# Altium schematic sheet 0180_WiFi_BT, LAN, WWAN.SchDoc
size 848 x 558 mm
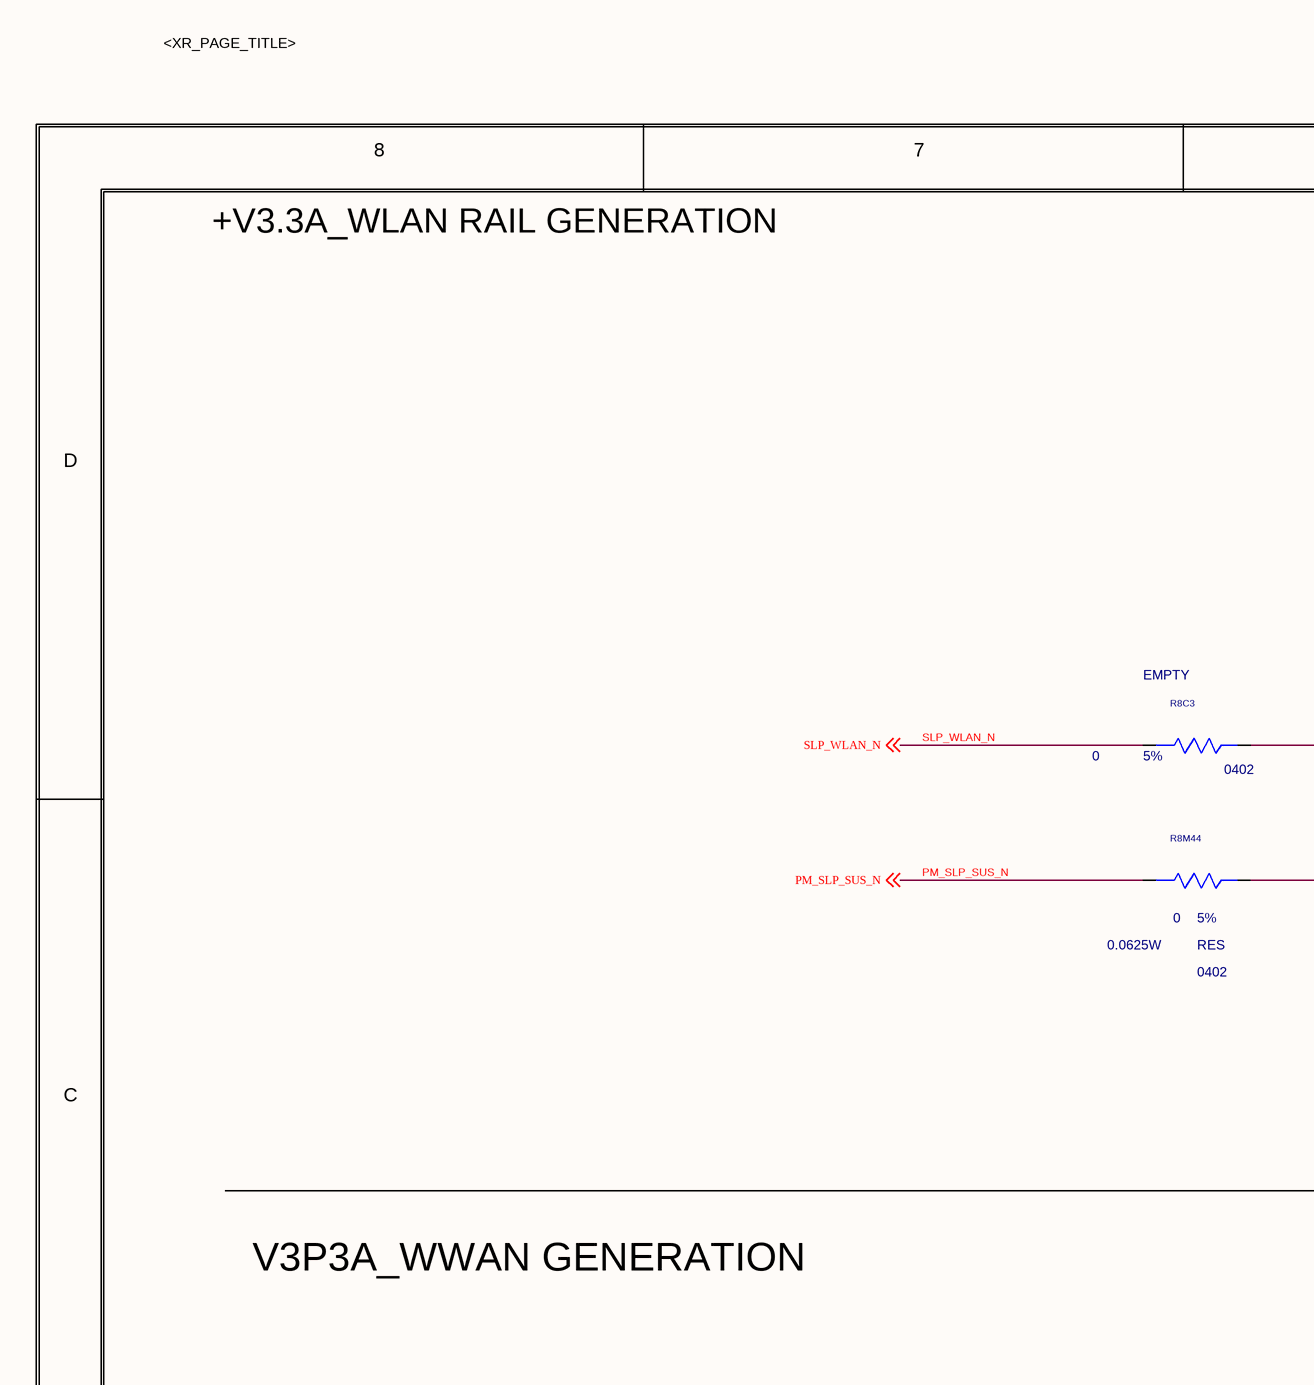
[diagram p0: 0180_WiFi_BT, LAN, WWAN.SchDoc, top left]
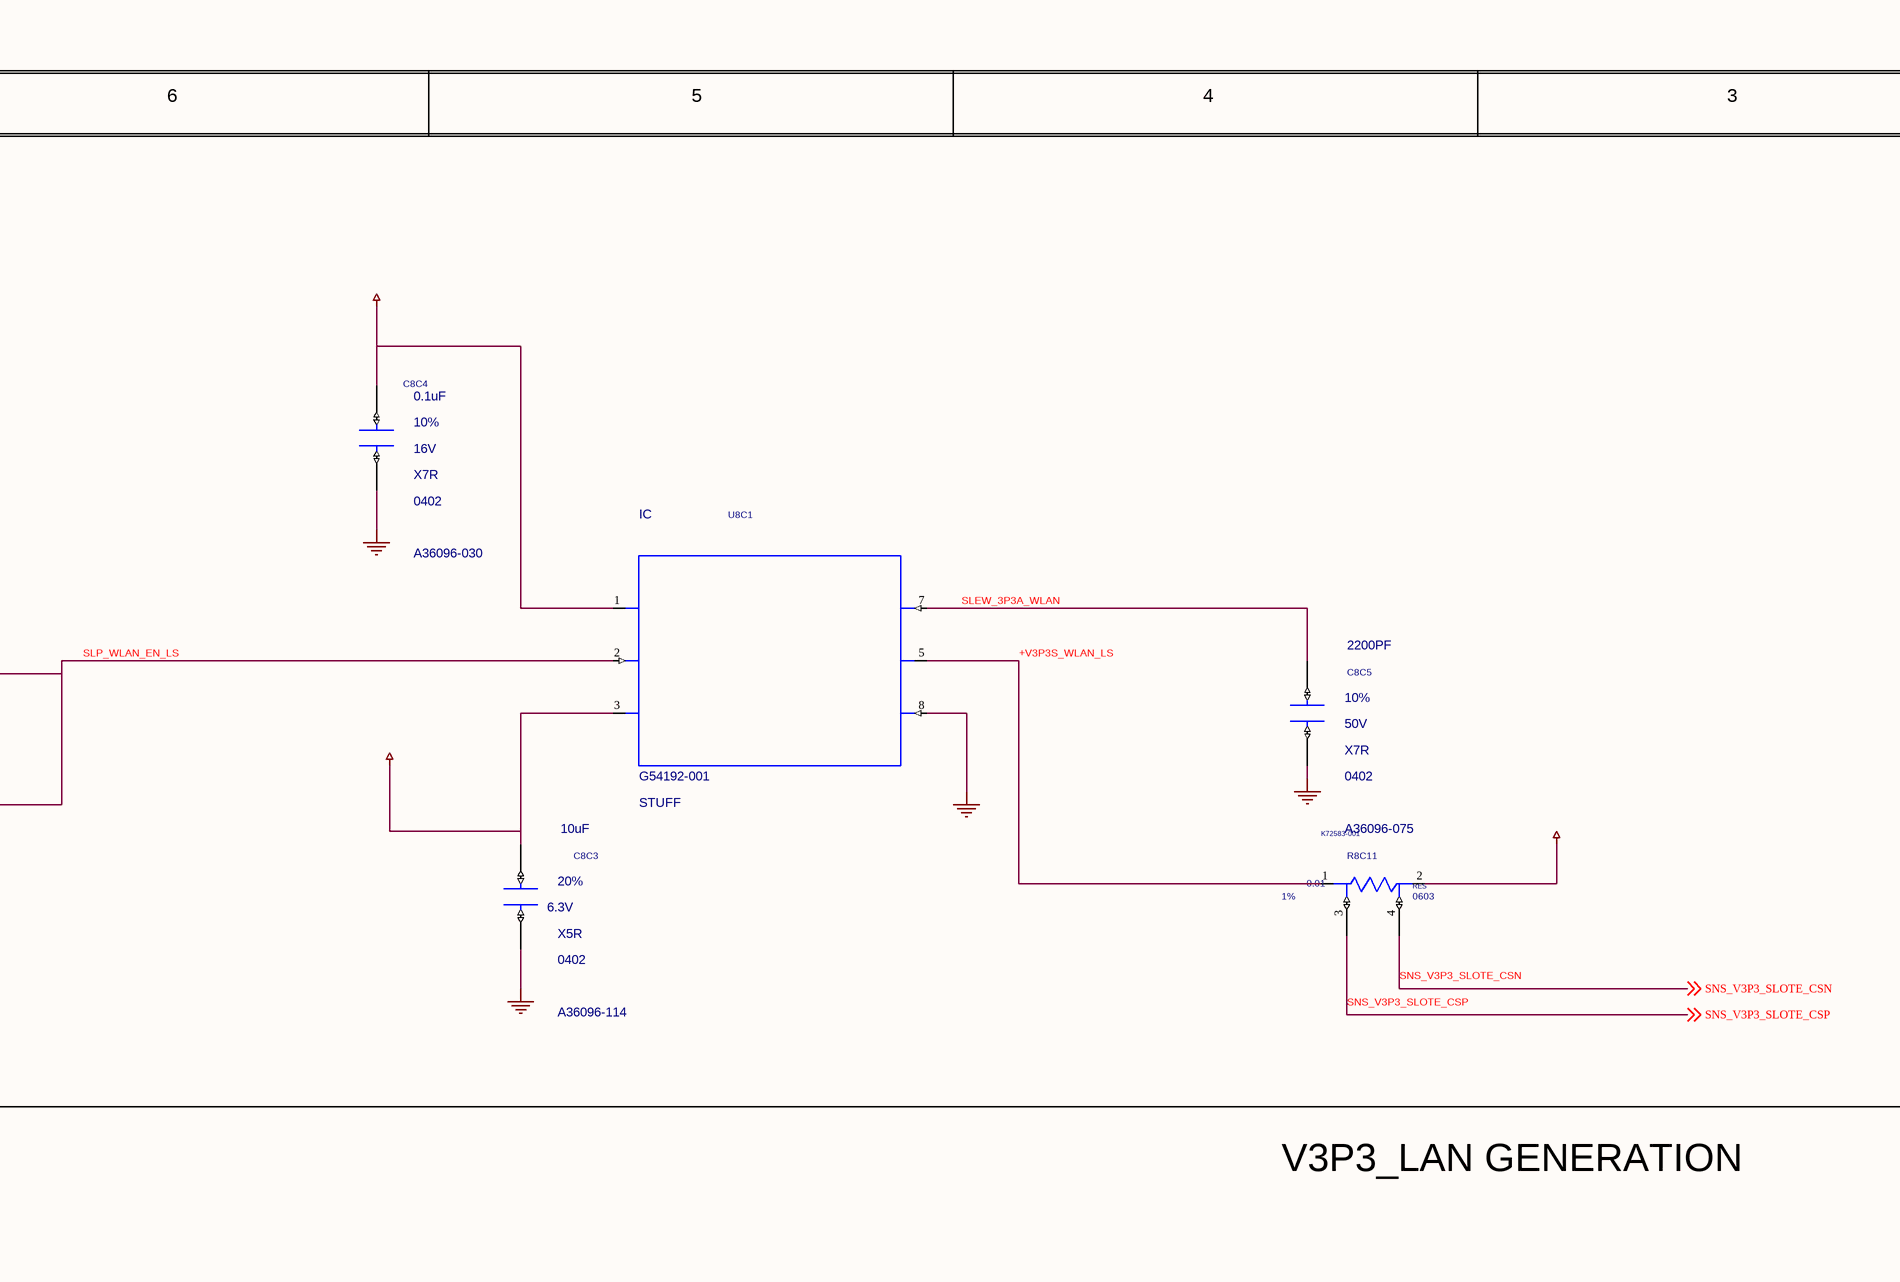
[diagram p1: 0180_WiFi_BT, LAN, WWAN.SchDoc, top middle]
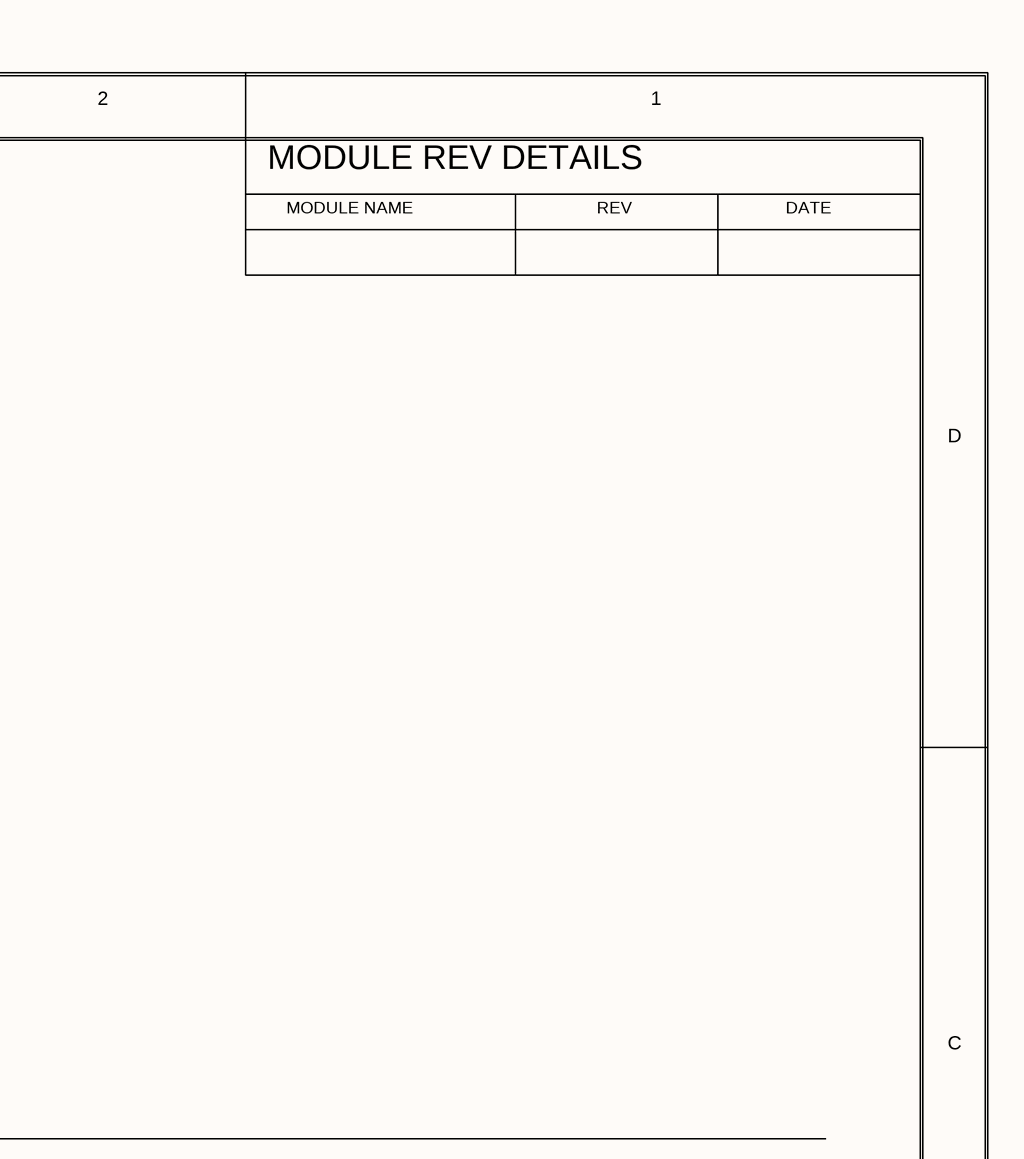
[diagram p2: 0180_WiFi_BT, LAN, WWAN.SchDoc, top right]
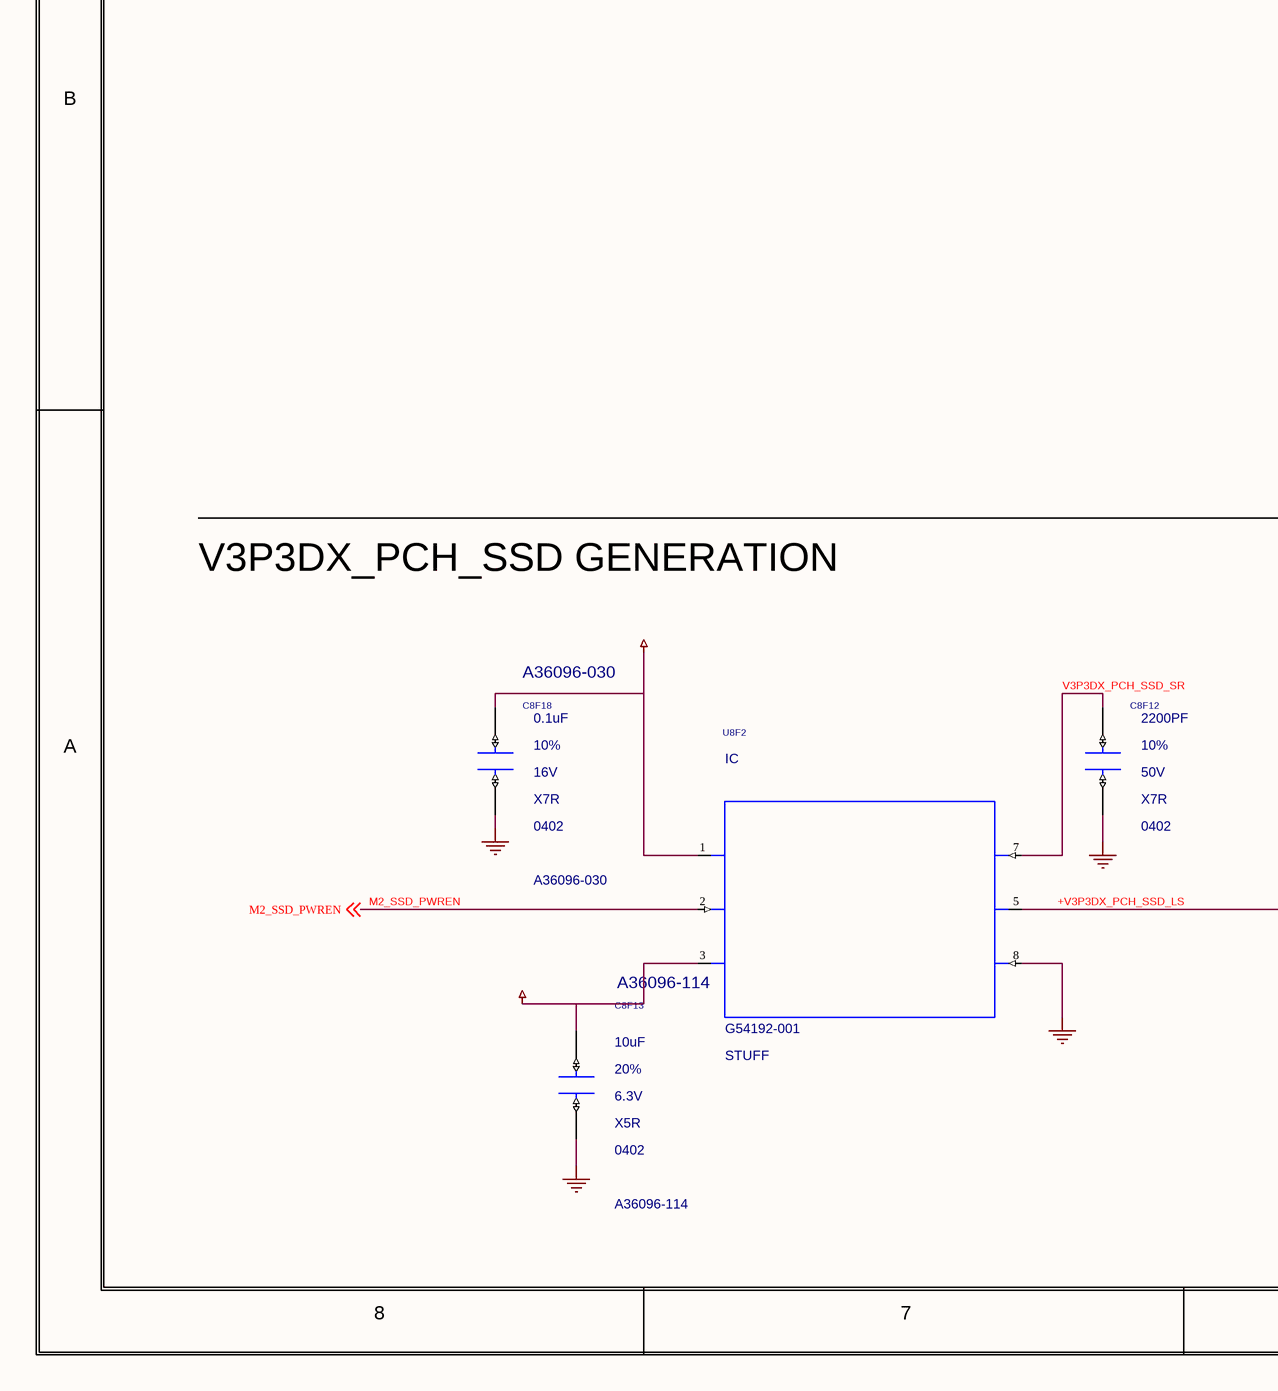
[diagram p3: 0180_WiFi_BT, LAN, WWAN.SchDoc, bottom left]
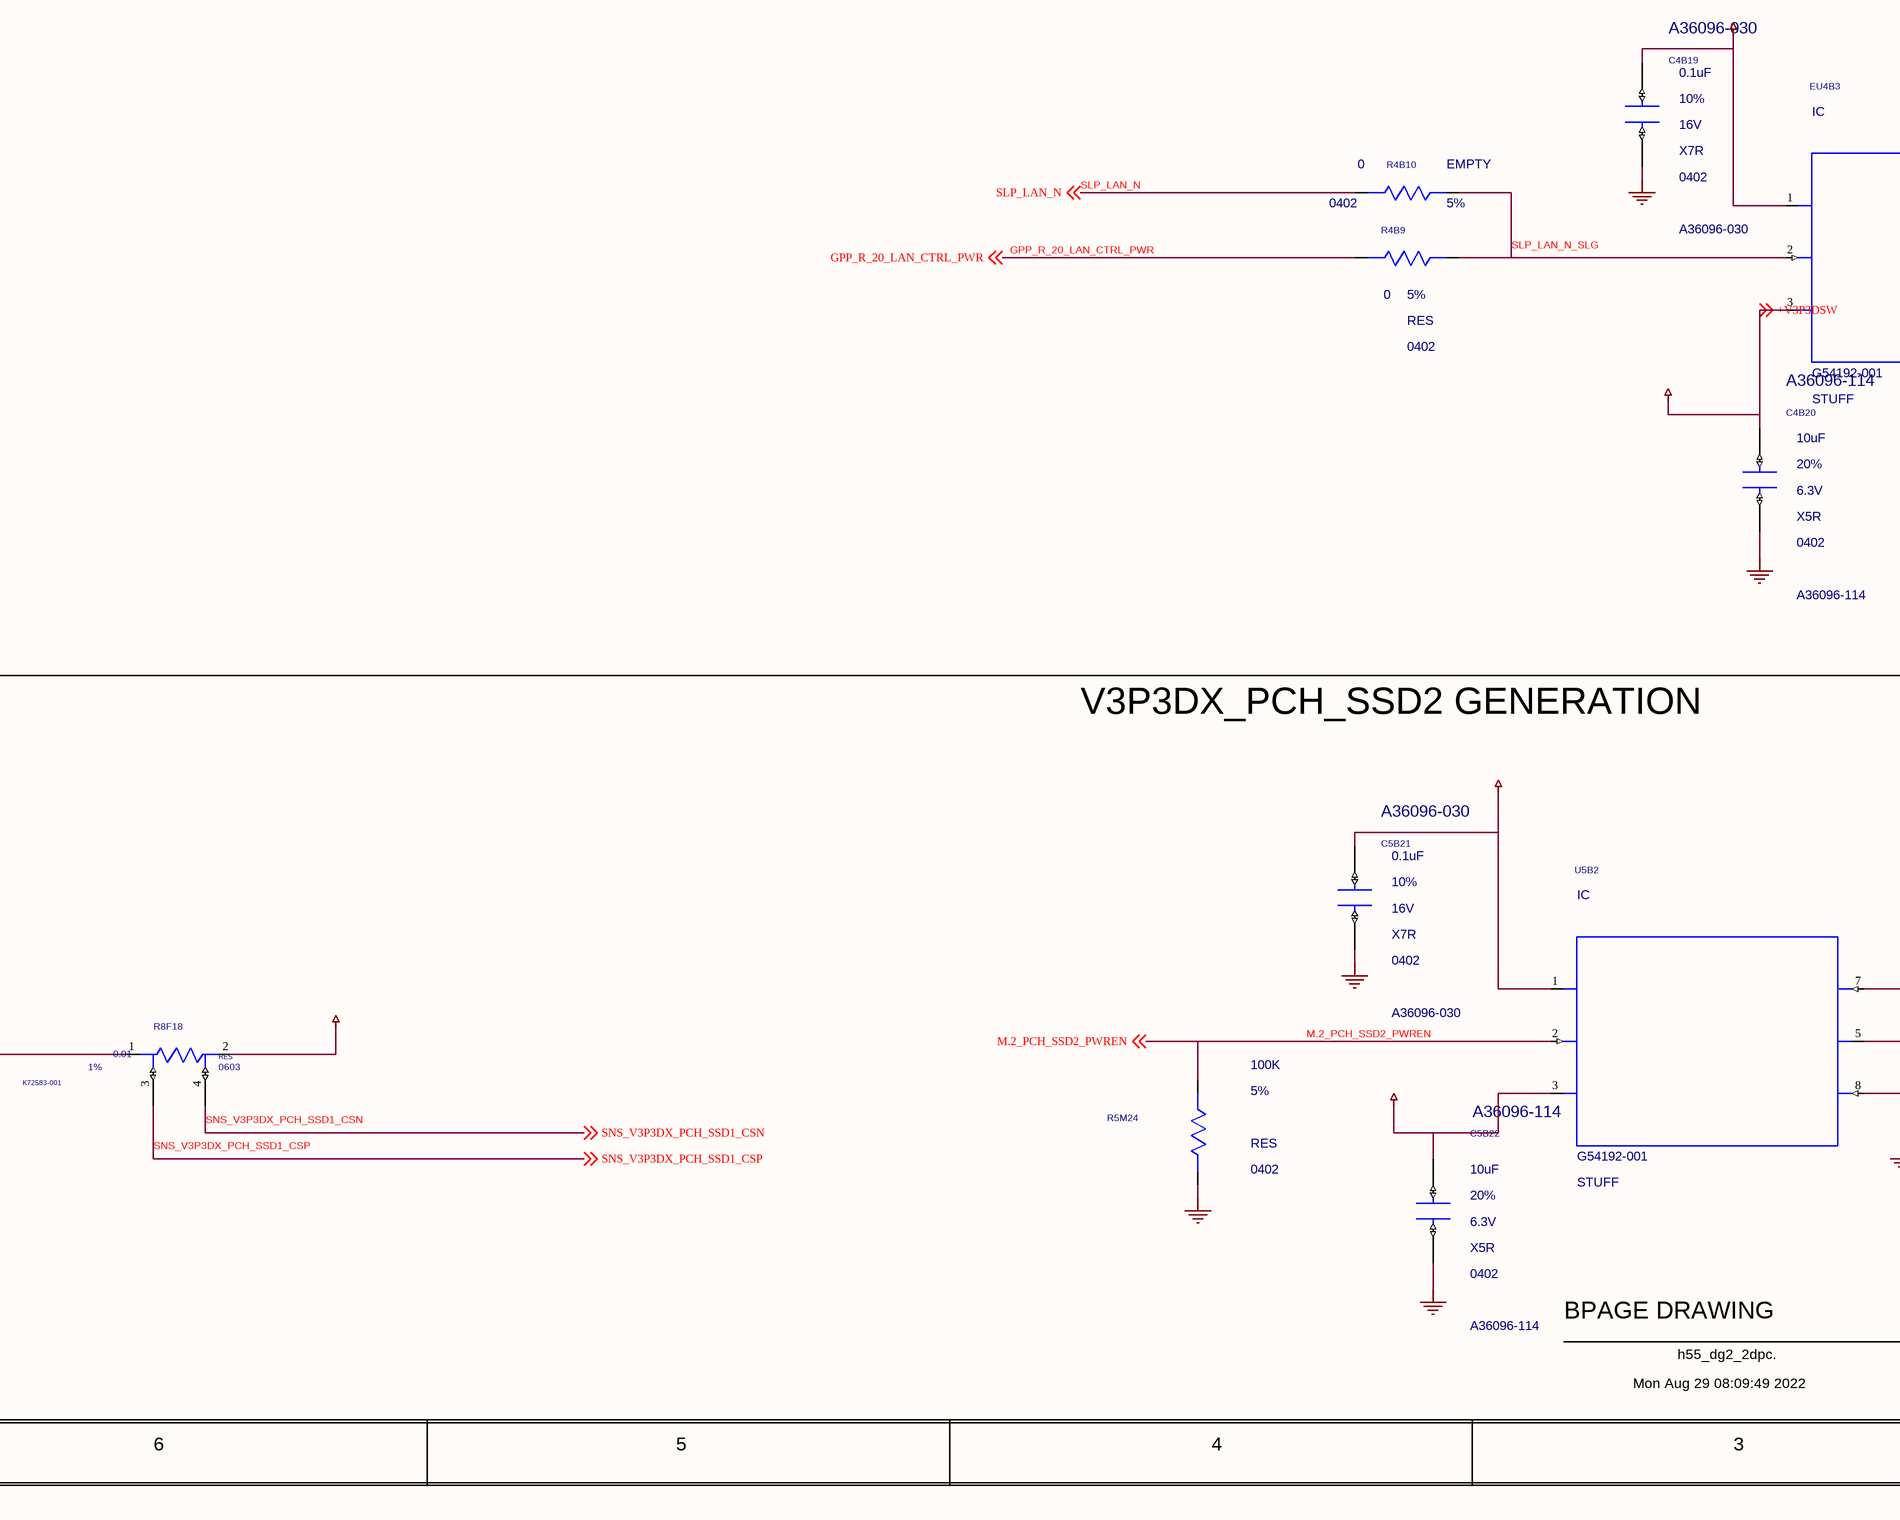
[diagram p4: 0180_WiFi_BT, LAN, WWAN.SchDoc, bottom middle]
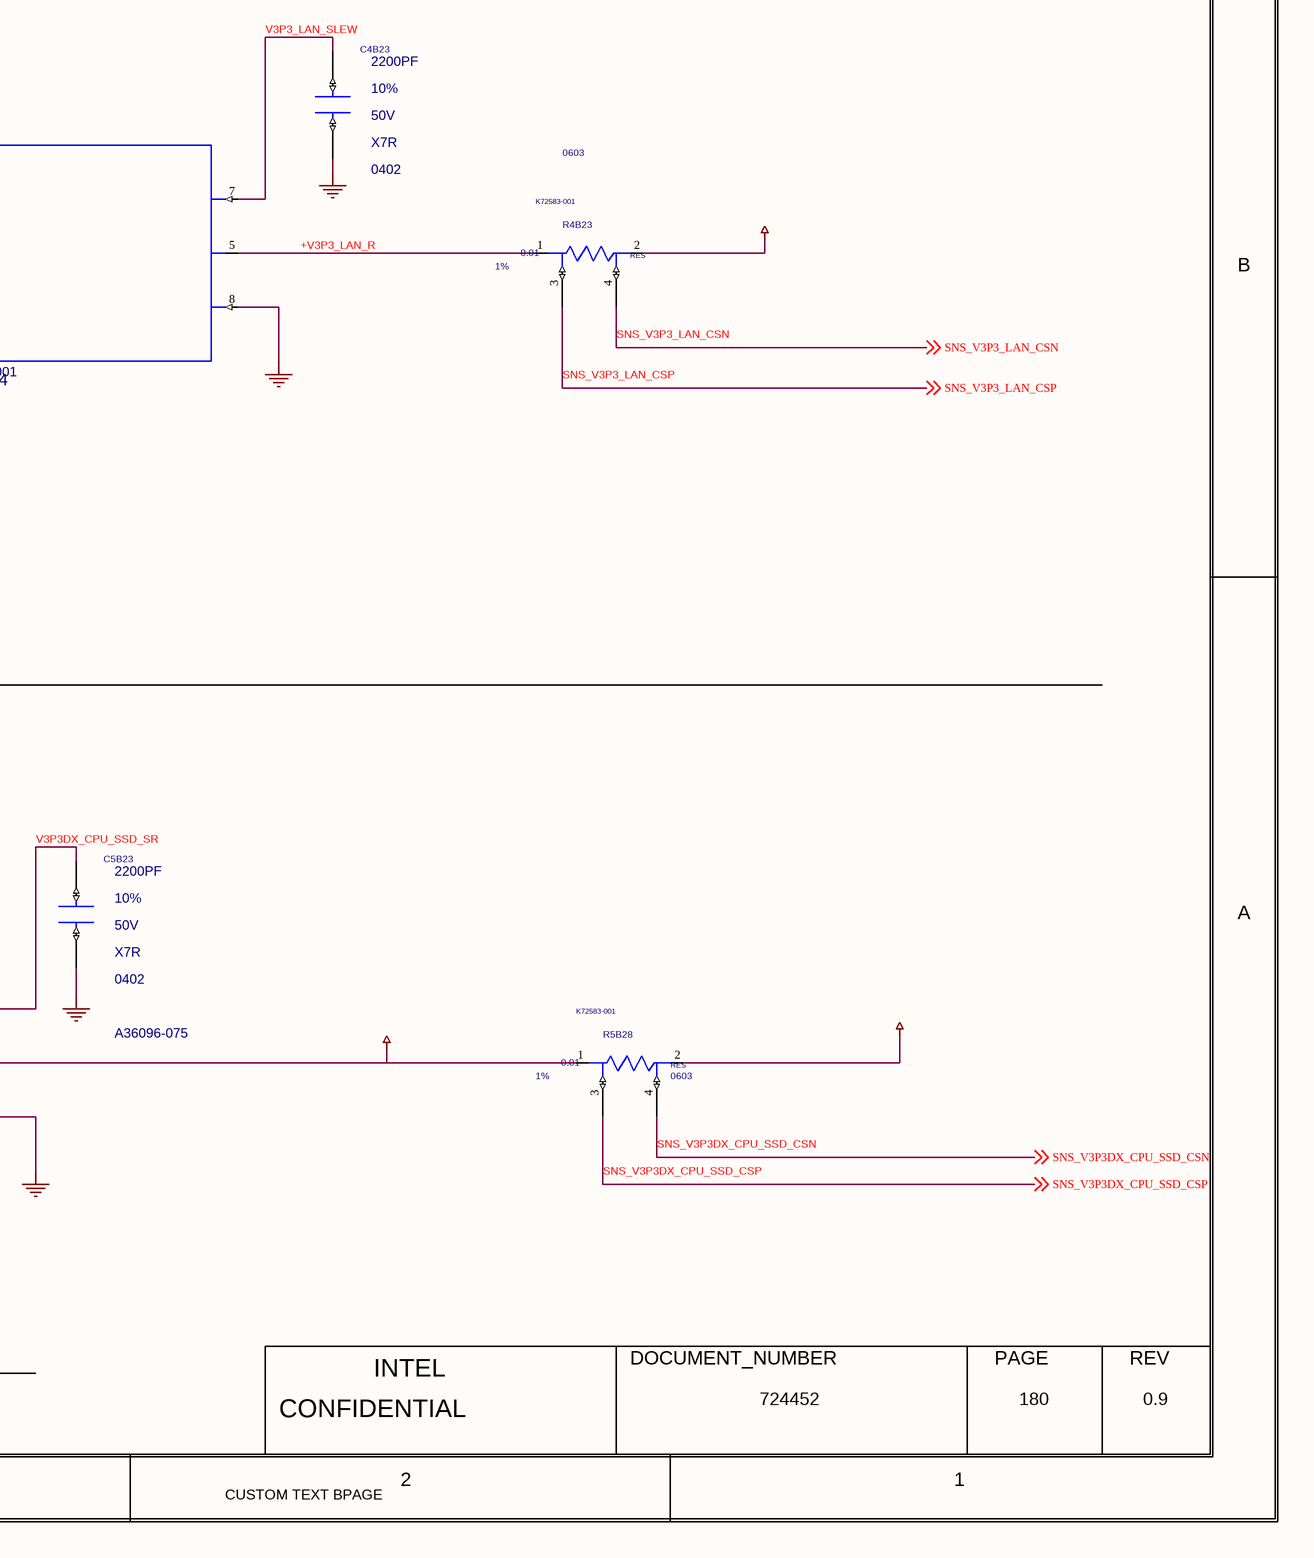
[diagram p5: 0180_WiFi_BT, LAN, WWAN.SchDoc, bottom right]

## Parts
C4B19  0.1uF  MATERIAL: X7R  PACK_TYPE: 0402  PART_NUMBER: A36096-030  TOLERANCE: 10%  VOLTAGE: 16V  [CTK0_SM0402_1050X550_MA]
C4B20  10uF  MATERIAL: X5R  PACK_TYPE: 0402  PART_NUMBER: A36096-114  TOLERANCE: 20%  VOLTAGE: 6.3V  [CTK0_SM0402_1200X700_MA]
C4B23  2200PF  MATERIAL: X7R  PACK_TYPE: 0402  TOLERANCE: 10%  VOLTAGE: 50V  [CTK0_SM0402_1100X600_MA]
C5B21  0.1uF  MATERIAL: X7R  PACK_TYPE: 0402  PART_NUMBER: A36096-030  TOLERANCE: 10%  VOLTAGE: 16V  [CTK0_SM0402_1050X550_MA]
C5B22  10uF  MATERIAL: X5R  PACK_TYPE: 0402  PART_NUMBER: A36096-114  TOLERANCE: 20%  VOLTAGE: 6.3V  [CTK0_SM0402_1200X700_MA]
C5B23  2200PF  MATERIAL: X7R  PACK_TYPE: 0402  PART_NUMBER: A36096-075  TOLERANCE: 10%  VOLTAGE: 50V  [CTK0_SM0402_1100X600_MA]
C8C3  10uF  MATERIAL: X5R  PACK_TYPE: 0402  PART_NUMBER: A36096-114  TOLERANCE: 20%  VOLTAGE: 6.3V  [CTK2_SM0402_1200X700_MA]
C8C4  0.1uF  MATERIAL: X7R  PACK_TYPE: 0402  PART_NUMBER: A36096-030  TOLERANCE: 10%  VOLTAGE: 16V  [CTK0_SM0402_1050X550_MA]
C8C5  2200PF  MATERIAL: X7R  PACK_TYPE: 0402  PART_NUMBER: A36096-075  TOLERANCE: 10%  VOLTAGE: 50V  [CTK0_SM0402_1100X600_MA]
C8F12  2200PF  MATERIAL: X7R  PACK_TYPE: 0402  TOLERANCE: 10%  VOLTAGE: 50V  [CTK0_SM0402_1100X600_MA]
C8F13  10uF  MATERIAL: X5R  PACK_TYPE: 0402  PART_NUMBER: A36096-114  TOLERANCE: 20%  VOLTAGE: 6.3V  [CTK0_SM0402_1200X700_MA]
C8F18  0.1uF  MATERIAL: X7R  PACK_TYPE: 0402  PART_NUMBER: A36096-030  TOLERANCE: 10%  VOLTAGE: 16V  [CTK0_SM0402_1050X550_MA]
EU4B3  BOM_USE: STUFF  MATERIAL: IC  PART_NUMBER: G54192-001  [TK2_LCC8_1550X2050_500_MA]  (hidden comment: SLG7NT402V_2)
R4B9  0  MATERIAL: RES  PACK_TYPE: 0402  TOLERANCE: 5%  [CTK2_SM0402_1100X550_MA]
R4B10  0  MATERIAL: EMPTY  PACK_TYPE: 0402  TOLERANCE: 5%  [CTK2_SM0402_1100X550_MA]
R4B23  0.01  MATERIAL: RES  PACK_TYPE: 0603  PART_NUMBER: K72583-001  TOLERANCE: 1%  [TK0_SMR4_0603_1800X1014_MB]
R5B28  0.01  MATERIAL: RES  PACK_TYPE: 0603  PART_NUMBER: K72583-001  TOLERANCE: 1%  [TK0_SMR4_0603_1800X1014_MB]
R5M24  100K  MATERIAL: RES  PACK_TYPE: 0402  TOLERANCE: 5%  [CTK2_SM0402_1100X550_MA]
R8C3  0  MATERIAL: EMPTY  PACK_TYPE: 0402  TOLERANCE: 5%  [CTK2_SM0402_1100X550_MA]
R8C11  0.01  MATERIAL: RES  PACK_TYPE: 0603  PART_NUMBER: K72583-001  TOLERANCE: 1%  [TK0_SMR4_0603_1800X1014_MB]
R8F18  0.01  MATERIAL: RES  PACK_TYPE: 0603  PART_NUMBER: K72583-001  TOLERANCE: 1%  [TK0_SMR4_0603_1800X1014_MB]
R8M44  0  MATERIAL: RES  PACK_TYPE: 0402  TOLERANCE: 5%  WATTAGE: 0.0625W  [CTK2_SM0402_1100X550_MA]
U5B2  BOM_USE: STUFF  MATERIAL: IC  PART_NUMBER: G54192-001  [TK2_LCC8_1550X2050_500_MA]  (hidden comment: SLG7NT402V_2)
U8C1  BOM_USE: STUFF  MATERIAL: IC  PART_NUMBER: G54192-001  [TK2_LCC8_1550X2050_500_MA]  (hidden comment: SLG7NT402V_2)
U8F2  BOM_USE: STUFF  MATERIAL: IC  PART_NUMBER: G54192-001  [TK2_LCC8_1550X2050_500_MA]  (hidden comment: SLG7NT402V_2)

## Nets
+V3P3_LAN: R4B23.2(PWRB)
+V3P3_SLOTE: R8C11.2(PWRB)
+V3P3DSW: C4B19.1(A) C4B20.1(A) C5B21.1(A) C5B22.1(A) C8C3.1(A) C8C4.1(A) C8F13.1(A) C8F18.1(A) EU4B3.1(VDD) EU4B3.3(D) U5B2.1(VDD) U5B2.3(D) U8C1.1(VDD) U8C1.3(D) U8F2.1(VDD) U8F2.3(D) ; off-sheet +V3P3DSW
+V3P3DX_PCH_SSD: R8F18.2(PWRB)
+V3P3DX_PCH_SSD2: R5B28.2(PWRB)
+V3P3DX_PCH_SSD2_LS: R5B28.1(PWRA) U5B2.5(S)
GND: C4B19.2(B) C4B20.2(B) C4B23.2(B) C5B21.2(B) C5B22.2(B) C5B23.2(B) C8C3.2(B) C8C4.2(B) C8C5.2(B) C8F12.2(B) C8F13.2(B) C8F18.2(B) EU4B3.8(GND) R5M24.2(B) U5B2.8(GND) U8C1.8(GND) U8F2.8(GND)
+V3P3_LAN_R: EU4B3.5(S) R4B23.1(PWRA)
+V3P3DX_PCH_SSD_LS: R8F18.1(PWRA) U8F2.5(S)
+V3P3S_WLAN_LS: R8C11.1(PWRA) U8C1.5(S)
GPP_R_20_LAN_CTRL_PWR: R4B9.1(A) ; off-sheet GPP_R_20_LAN_CTRL_PWR
M2_SSD_PWREN: U8F2.2(ON) ; off-sheet M2_SSD_PWREN
M.2_PCH_SSD2_PWREN: R5M24.1(A) U5B2.2(ON) ; off-sheet M.2_PCH_SSD2_PWREN
PM_SLP_SUS_N: R8M44.1(A) ; off-sheet PM_SLP_SUS_N
SLEW_3P3A_WLAN: C8C5.1(A) U8C1.7(CAP)
SLP_LAN_N: R4B10.1(A) ; off-sheet SLP_LAN_N
SLP_LAN_N_SLG: EU4B3.2(ON) R4B9.2(B) R4B10.2(B)
SLP_WLAN_EN_LS: R8C3.2(B) R8M44.2(B) U8C1.2(ON)
SLP_WLAN_N: R8C3.1(A) ; off-sheet SLP_WLAN_N
SNS_V3P3_LAN_CSN: R4B23.4(SENB) ; off-sheet SNS_V3P3_LAN_CSN
SNS_V3P3_LAN_CSP: R4B23.3(SENA) ; off-sheet SNS_V3P3_LAN_CSP
SNS_V3P3_SLOTE_CSN: R8C11.4(SENB) ; off-sheet SNS_V3P3_SLOTE_CSN
SNS_V3P3_SLOTE_CSP: R8C11.3(SENA) ; off-sheet SNS_V3P3_SLOTE_CSP
SNS_V3P3DX_CPU_SSD_CSN: R5B28.4(SENB) ; off-sheet SNS_V3P3DX_CPU_SSD_CSN
SNS_V3P3DX_CPU_SSD_CSP: R5B28.3(SENA) ; off-sheet SNS_V3P3DX_CPU_SSD_CSP
SNS_V3P3DX_PCH_SSD1_CSN: R8F18.4(SENB) ; off-sheet SNS_V3P3DX_PCH_SSD1_CSN
SNS_V3P3DX_PCH_SSD1_CSP: R8F18.3(SENA) ; off-sheet SNS_V3P3DX_PCH_SSD1_CSP
V3P3_LAN_SLEW: C4B23.1(A) EU4B3.7(CAP)
V3P3DX_CPU_SSD_SR: C5B23.1(A) U5B2.7(CAP)
V3P3DX_PCH_SSD_SR: C8F12.1(A) U8F2.7(CAP)

## Notes on the sheet
- <XR_PAGE_TITLE>
- 8
- 7
- 6
- 5
- 4
- 3
- 2
- 1
- +V3.3A_WLAN RAIL GENERATION
- MODULE REV DETAILS
- MODULE NAME
- REV
- DATE
- D
- C
- V3P3_LAN GENERATION
- V3P3A_WWAN GENERATION
- B
- V3P3DX_PCH_SSD GENERATION
- V3P3DX_PCH_SSD2 GENERATION
- A
- BPAGE DRAWING
- INTEL
- DOCUMENT_NUMBER
- PAGE
- Mon Aug 29 08:09:49 2022
- h55_dg2_2dpc.
- CONFIDENTIAL
- 724452
- 180
- 0.9
- CUSTOM TEXT BPAGE

## Library data of the parts
C4B19 = C_CAP: CDS_PHYS_PART_NAME: C_CAP_0402-A36096-030,X7R,0.1UF,16V,10%,TK0,GENERIC; CDS_LMAN_SYM_OUTLINE: -50,50,50,-50; FP_TECH: TK0; IP: GENERIC; ROOM: NONE; OriginalSymbolOrigin: (-50,25); XY: (4800,5025); VER: 1; ROT: 0; PHYS_PAGE: 180; LOCATION: C4B19; DRAWING: @RVP1_ADL_SB_ADP_S_DDR5_SODIMM_2DPC_LIB.H55_DG2_2DPC(SCH_1):PAGE549; CDS_LIB: c_discrete; VARIANT: ?; PCB Footprint: CTK0_SM0402_1050X550_MA; CHIPS_PART_NAME: C_CAP; CDS_PART_NAME: C_CAP_0402-A36096-030,X7R,0.1UF,16V,10%,TK0,GENERIC; CDS_LOCATION: C4B19; ASI_MODEL: A36096-030
C4B20 = C_CAP: CDS_PHYS_PART_NAME: C_CAP_0402-A36096-114,X5R,10UF,6.3V,20%,TK0,GENERIC; CDS_LMAN_SYM_OUTLINE: -50,50,50,-50; FP_TECH: TK0; IP: GENERIC; ROOM: NONE; OriginalSymbolOrigin: (-50,25); XY: (5025,4325); VER: 1; ROT: 0; PHYS_PAGE: 180; LOCATION: C4B20; FIN: VREG_CPU_DCPL; DRAWING: @RVP1_ADL_SB_ADP_S_DDR5_SODIMM_2DPC_LIB.H55_DG2_2DPC(SCH_1):PAGE549; CDS_LIB: c_discrete; BOM: CORE_VREG_CPU; VARIANT: ?; PCB Footprint: CTK0_SM0402_1200X700_MA; CHIPS_PART_NAME: C_CAP; CDS_PART_NAME: C_CAP_0402-A36096-114,X5R,10UF,6.3V,20%,TK0,GENERIC; CDS_LOCATION: C4B20; ASI_MODEL: A36096-114
C4B23 = C_CAP: PART_NUMBER: A36096-075; CDS_PHYS_PART_NAME: CAP_402-2200PF,10%,50V"; CDS_PART_NAME: C_CAP_0402-A36096-075,X7R,2200PF,50V,10%,TK0,GENERIC; CDS_LMAN_SYM_OUTLINE: -50,50,50,-50; FP_TECH: TK0; IP: GENERIC; ROOM: NONE; OriginalSymbolOrigin: (-50,25); XY: (5850,5025); VER: 1; ROT: 0; PHYS_PAGE: 180; LOCATION: C4B23; DRAWING: @RVP1_ADL_SB_ADP_S_DDR5_SODIMM_2DPC_LIB.H55_DG2_2DPC(SCH_1):PAGE549; CDS_LIB: c_discrete; VARIANT: ?; PCB Footprint: CTK0_SM0402_1100X600_MA; CHIPS_PART_NAME: C_CAP; CDS_LOCATION: C4B23; ASI_MODEL: A36096-075
C5B21 = C_CAP: CDS_PHYS_PART_NAME: C_CAP_0402-A36096-030,X7R,0.1UF,16V,10%,TK0,GENERIC; CDS_LMAN_SYM_OUTLINE: -50,50,50,-50; FP_TECH: TK0; IP: GENERIC; ROOM: NONE; OriginalSymbolOrigin: (-50,25); XY: (4250,3525); VER: 1; ROT: 0; PHYS_PAGE: 180; LOCATION: C5B21; DRAWING: @RVP1_ADL_SB_ADP_S_DDR5_SODIMM_2DPC_LIB.H55_DG2_2DPC(SCH_1):PAGE549; CDS_LIB: c_discrete; VARIANT: ?; PCB Footprint: CTK0_SM0402_1050X550_MA; CHIPS_PART_NAME: C_CAP; CDS_PART_NAME: C_CAP_0402-A36096-030,X7R,0.1UF,16V,10%,TK0,GENERIC; CDS_LOCATION: C5B21; ASI_MODEL: A36096-030
C5B22 = C_CAP: CDS_PHYS_PART_NAME: C_CAP_0402-A36096-114,X5R,10UF,6.3V,20%,TK0,GENERIC; CDS_LMAN_SYM_OUTLINE: -50,50,50,-50; FP_TECH: TK0; IP: GENERIC; ROOM: NONE; OriginalSymbolOrigin: (-50,25); XY: (4400,2925); VER: 1; ROT: 0; PHYS_PAGE: 180; LOCATION: C5B22; FIN: VREG_CPU_DCPL; DRAWING: @RVP1_ADL_SB_ADP_S_DDR5_SODIMM_2DPC_LIB.H55_DG2_2DPC(SCH_1):PAGE549; CDS_LIB: c_discrete; BOM: CORE_VREG_CPU; VARIANT: ?; PCB Footprint: CTK0_SM0402_1200X700_MA; CHIPS_PART_NAME: C_CAP; CDS_PART_NAME: C_CAP_0402-A36096-114,X5R,10UF,6.3V,20%,TK0,GENERIC; CDS_LOCATION: C5B22; ASI_MODEL: A36096-114
C5B23 = C_CAP: CDS_PHYS_PART_NAME: C_CAP_0402-A36096-075,X7R,2200PF,50V,10%,TK0,GENERIC; CDS_LMAN_SYM_OUTLINE: -50,50,50,-50; FP_TECH: TK0; IP: GENERIC; ROOM: NONE; OriginalSymbolOrigin: (-50,25); XY: (5375,3525); VER: 1; ROT: 0; PHYS_PAGE: 180; LOCATION: C5B23; DRAWING: @RVP1_ADL_SB_ADP_S_DDR5_SODIMM_2DPC_LIB.H55_DG2_2DPC(SCH_1):PAGE549; CDS_LIB: c_discrete; VARIANT: ?; PCB Footprint: CTK0_SM0402_1100X600_MA; CHIPS_PART_NAME: C_CAP; CDS_PART_NAME: C_CAP_0402-A36096-075,X7R,2200PF,50V,10%,TK0,GENERIC; CDS_LOCATION: C5B23; ASI_MODEL: A36096-075
C8C3 = C_CAP: CDS_PHYS_PART_NAME: C_CAP_0402-A36096-114,X5R,10UF,6.3V,20%,TK2,GENERIC; CDS_LMAN_SYM_OUTLINE: -50,50,50,-50; FP_TECH: TK2; IP: GENERIC; ROOM: NONE; OriginalSymbolOrigin: (-50,25); XY: (2650,6075); VER: 1; ROT: 0; PHYS_PAGE: 180; LOCATION: C8C3; DRAWING: @RVP1_ADL_SB_ADP_S_DDR5_SODIMM_2DPC_LIB.H55_DG2_2DPC(SCH_1):PAGE549; CDS_LIB: c_discrete; VARIANT: ?; PCB Footprint: CTK2_SM0402_1200X700_MA; CHIPS_PART_NAME: C_CAP; CDS_PART_NAME: C_CAP_0402-A36096-114,X5R,10UF,6.3V,20%,TK2,GENERIC; CDS_LOCATION: C8C3
C8C4 = C_CAP: CDS_PHYS_PART_NAME: C_CAP_0402-A36096-030,X7R,0.1UF,16V,10%,TK0,GENERIC; CDS_LMAN_SYM_OUTLINE: -50,50,50,-50; FP_TECH: TK0; IP: GENERIC; ROOM: NONE; OriginalSymbolOrigin: (-50,25); XY: (2375,6950); VER: 1; ROT: 0; PHYS_PAGE: 180; LOCATION: C8C4; DRAWING: @RVP1_ADL_SB_ADP_S_DDR5_SODIMM_2DPC_LIB.H55_DG2_2DPC(SCH_1):PAGE549; CDS_LIB: c_discrete; VARIANT: ?; PCB Footprint: CTK0_SM0402_1050X550_MA; CHIPS_PART_NAME: C_CAP; CDS_PART_NAME: C_CAP_0402-A36096-030,X7R,0.1UF,16V,10%,TK0,GENERIC; CDS_LOCATION: C8C4
C8C5 = C_CAP: CDS_PHYS_PART_NAME: C_CAP_0402-A36096-075,X7R,2200PF,50V,10%,TK0,GENERIC; CDS_LMAN_SYM_OUTLINE: -50,50,50,-50; FP_TECH: TK0; IP: GENERIC; ROOM: NONE; OriginalSymbolOrigin: (-50,25); XY: (4150,6425); VER: 1; ROT: 0; PHYS_PAGE: 180; LOCATION: C8C5; DRAWING: @RVP1_ADL_SB_ADP_S_DDR5_SODIMM_2DPC_LIB.H55_DG2_2DPC(SCH_1):PAGE549; CDS_LIB: c_discrete; VARIANT: ?; PCB Footprint: CTK0_SM0402_1100X600_MA; CHIPS_PART_NAME: C_CAP; CDS_PART_NAME: C_CAP_0402-A36096-075,X7R,2200PF,50V,10%,TK0,GENERIC; CDS_LOCATION: C8C5
C8F12 = C_CAP: PART_NUMBER: A36096-075; CDS_PHYS_PART_NAME: C_CAP_0402-A36096-075,X7R,2200PF,50V,10%,TK0,GENERIC; CDS_LMAN_SYM_OUTLINE: -50,50,50,-50; FP_TECH: TK0; IP: GENERIC; ROOM: NONE; OriginalSymbolOrigin: (-50,25); XY: (1325,3500); VER: 1; ROT: 0; PHYS_PAGE: 180; LOCATION: C8F12; DRAWING: @RVP1_ADL_SB_ADP_S_DDR5_SODIMM_2DPC_LIB.H55_DG2_2DPC(SCH_1):PAGE549; CDS_LIB: c_discrete; VARIANT: ?; PCB Footprint: CTK0_SM0402_1100X600_MA; CHIPS_PART_NAME: C_CAP; CDS_PART_NAME: C_CAP_0402-A36096-075,X7R,2200PF,50V,10%,TK0,GENERIC; CDS_LOCATION: C8F12; ASI_MODEL: A36096-075
C8F13 = C_CAP: CDS_PHYS_PART_NAME: C_CAP_0402-A36096-114,X5R,10UF,6.3V,20%,TK0,GENERIC; CDS_LMAN_SYM_OUTLINE: -50,50,50,-50; FP_TECH: TK0; IP: GENERIC; ROOM: NONE; OriginalSymbolOrigin: (-50,25); XY: (350,2900); VER: 1; ROT: 0; PHYS_PAGE: 180; LOCATION: C8F13; FIN: VREG_CPU_DCPL; DRAWING: @RVP1_ADL_SB_ADP_S_DDR5_SODIMM_2DPC_LIB.H55_DG2_2DPC(SCH_1):PAGE549; CDS_LIB: c_discrete; BOM: CORE_VREG_CPU; VARIANT: ?; PCB Footprint: CTK0_SM0402_1200X700_MA; CHIPS_PART_NAME: C_CAP; CDS_PART_NAME: C_CAP_0402-A36096-114,X5R,10UF,6.3V,20%,TK0,GENERIC; CDS_LOCATION: C8F13; ASI_MODEL: A36096-114
C8F18 = C_CAP: CDS_PHYS_PART_NAME: C_CAP_0402-A36096-030,X7R,0.1UF,16V,10%,TK0,GENERIC; CDS_LMAN_SYM_OUTLINE: -50,50,50,-50; FP_TECH: TK0; IP: GENERIC; ROOM: NONE; OriginalSymbolOrigin: (-50,25); XY: (200,3500); VER: 1; ROT: 0; PHYS_PAGE: 180; LOCATION: C8F18; DRAWING: @RVP1_ADL_SB_ADP_S_DDR5_SODIMM_2DPC_LIB.H55_DG2_2DPC(SCH_1):PAGE549; CDS_LIB: c_discrete; VARIANT: ?; PCB Footprint: CTK0_SM0402_1050X550_MA; CHIPS_PART_NAME: C_CAP; CDS_PART_NAME: C_CAP_0402-A36096-030,X7R,0.1UF,16V,10%,TK0,GENERIC; CDS_LOCATION: C8F18; ASI_MODEL: A36096-030
EU4B3 = SLG7NT402V_2: CDS_PHYS_PART_NAME: SLG7NT402V_2_LCC-G54192-001,IC,SLG7NT402V,TK2,GENERIC; CDS_LMAN_SYM_OUTLINE: -250,200,250,-200; FP_TECH: TK2; IP: GENERIC; PACK_TYPE: LCC; ROOM: NONE; OriginalSymbolOrigin: (-275,200); XY: (5375,4750); VER: 1; ROT: 0; PHYS_PAGE: 180; LOCATION: EU4B3; DRAWING: @RVP1_ADL_SB_ADP_S_DDR5_SODIMM_2DPC_LIB.H55_DG2_2DPC(SCH_1):PAGE549; CDS_LIB: local; VARIANT: ?; PCB Footprint: TK2_LCC8_1550X2050_500_MA; SEC_TYPE: LCC; CHIPS_PART_NAME: SLG7NT402V_2; CDS_PART_NAME: SLG7NT402V_2_LCC-G54192-001,IC,SLG7NT402V,TK2,GENERIC; CDS_LOCATION: EU4B3; ASI_MODEL: G54192-001
R4B9 = C_RES#1: PART_NUMBER: A93549-001; CHIPS_PART_NAME: C_RES; CDS_PHYS_PART_NAME: C_RES_0402-A93549-001,RES,0,5%,0.0625W,TK2,GENERIC; CDS_LMAN_SYM_OUTLINE: -50,50,50,-50; FP_TECH: TK2; IP: GENERIC; ROOM: NONE; WATTAGE: 0.0625W; OriginalSymbolOrigin: (-75,25); XY: (4350,4750); VER: 1; PHYS_PAGE: 180; LOCATION: R4B9; DRAWING: @RVP1_ADL_SB_ADP_S_DDR5_SODIMM_2DPC_LIB.H55_DG2_2DPC(SCH_1):PAGE549; CDS_LIB: c_discrete; VARIANT: ?; PCB Footprint: CTK2_SM0402_1100X550_MA; ROT: 0; CDS_PART_NAME: C_RES_0402-A93549-001,RES,0,5%,0.0625W,TK2,GENERIC; CDS_LOCATION: R4B9; ASI_MODEL: A93549-001
R4B10 = C_RES#1: PART_NUMBER: A93549-001; CHIPS_PART_NAME: C_RES; CDS_PHYS_PART_NAME: RES_402-0,5%,402"; CDS_PART_NAME: C_RES_0402-A93549-001,EMPTY,0,5%,0.0625W,TK2,GENERIC; CDS_LMAN_SYM_OUTLINE: -50,50,50,-50; FP_TECH: TK2; IP: GENERIC; ROOM: NONE; WATTAGE: 0.0625W; OriginalSymbolOrigin: (-75,25); XY: (4350,4875); VER: 1; PHYS_PAGE: 180; LOCATION: R4B10; DRAWING: @RVP1_ADL_SB_ADP_S_DDR5_SODIMM_2DPC_LIB.H55_DG2_2DPC(SCH_1):PAGE549; CDS_LIB: c_discrete; VARIANT: ?; PCB Footprint: CTK2_SM0402_1100X550_MA; ROT: 0; CDS_LOCATION: R4B10; ASI_MODEL: A93549-001
R4B23 = RES_4TERM_2: CDS_PHYS_PART_NAME: RES_4TERM_2_0603-K72583-001,RES,0.01,1%,0.1W,TK0,GENERIC; CDS_LMAN_SYM_OUTLINE: -50,50,50,-50; FP_TECH: TK0; IP: GENERIC; ROOM: NONE; WATTAGE: 0.1W; OriginalSymbolOrigin: (-75,25); XY: (6325,4750); VER: 1; ROT: 0; PHYS_PAGE: 180; LOCATION: R4B23; DRAWING: @RVP1_ADL_SB_ADP_S_DDR5_SODIMM_2DPC_LIB.H55_DG2_2DPC(SCH_1):PAGE549; CDS_LIB: discrete_2; VARIANT: ?; PCB Footprint: TK0_SMR4_0603_1800X1014_MB; CHIPS_PART_NAME: RES_4TERM_2; CDS_PART_NAME: RES_4TERM_2_0603-K72583-001,RES,0.01,1%,0.1W,TK0,GENERIC; CDS_LOCATION: R4B23; ASI_MODEL: K72583-001
R5B28 = RES_4TERM_2: CDS_PHYS_PART_NAME: RES_4TERM_2_0603-K72583-001,RES,0.01,1%,0.1W,TK0,GENERIC; CDS_LMAN_SYM_OUTLINE: -50,50,50,-50; FP_TECH: TK0; IP: GENERIC; ROOM: NONE; WATTAGE: 0.1W; OriginalSymbolOrigin: (-75,25); XY: (6400,3250); VER: 1; ROT: 0; PHYS_PAGE: 180; LOCATION: R5B28; DRAWING: @RVP1_ADL_SB_ADP_S_DDR5_SODIMM_2DPC_LIB.H55_DG2_2DPC(SCH_1):PAGE549; CDS_LIB: discrete_2; VARIANT: ?; PCB Footprint: TK0_SMR4_0603_1800X1014_MB; CHIPS_PART_NAME: RES_4TERM_2; CDS_PART_NAME: RES_4TERM_2_0603-K72583-001,RES,0.01,1%,0.1W,TK0,GENERIC; CDS_LOCATION: R5B28; ASI_MODEL: K72583-001
R5M24 = C_RES: PART_NUMBER: A93549-027; CDS_PHYS_PART_NAME: C_RES_0402-A93549-027,RES,100K,5%,0.0625W,TK2,GENERIC; CDS_LMAN_SYM_OUTLINE: -50,50,50,-50; FP_TECH: TK2; IP: GENERIC; ROOM: NONE; WATTAGE: 0.0625W; OriginalSymbolOrigin: (-25,75); XY: (3950,3075); VER: 2; ROT: 0; PHYS_PAGE: 180; LOCATION: R5M24; DRAWING: @RVP1_ADL_SB_ADP_S_DDR5_SODIMM_2DPC_LIB.H55_DG2_2DPC(SCH_1):PAGE549; CDS_LIB: c_discrete; VARIANT: ?; PCB Footprint: CTK2_SM0402_1100X550_MA; CHIPS_PART_NAME: C_RES; CDS_PART_NAME: C_RES_0402-A93549-027,RES,100K,5%,0.0625W,TK2,GENERIC; CDS_LOCATION: R5M24; ASI_MODEL: A93549-027
R8C3 = C_RES#1: PART_NUMBER: A93549-001; CHIPS_PART_NAME: C_RES; CDS_PHYS_PART_NAME: C_RES_0402-A93549-001,EMPTY,0,5%,0.0625W,TK2,GENERIC; CDS_LMAN_SYM_OUTLINE: -50,50,50,-50; FP_TECH: TK2; IP: GENERIC; ROOM: NONE; WATTAGE: 0.0625W; OriginalSymbolOrigin: (-75,25); XY: (1500,6500); VER: 1; PHYS_PAGE: 180; LOCATION: R8C3; DRAWING: @RVP1_ADL_SB_ADP_S_DDR5_SODIMM_2DPC_LIB.H55_DG2_2DPC(SCH_1):PAGE549; CDS_LIB: c_discrete; VARIANT: ?; PCB Footprint: CTK2_SM0402_1100X550_MA; ROT: 0; CDS_PART_NAME: C_RES_0402-A93549-001,EMPTY,0,5%,0.0625W,TK2,GENERIC; CDS_LOCATION: R8C3
R8C11 = RES_4TERM_2: CDS_PHYS_PART_NAME: RES_4TERM_2_0603-K72583-001,RES,0.01,1%,0.1W,TK0,GENERIC; CDS_LMAN_SYM_OUTLINE: -50,50,50,-50; FP_TECH: TK0; IP: GENERIC; ROOM: NONE; WATTAGE: 0.1W; OriginalSymbolOrigin: (-75,25); XY: (4275,6100); VER: 1; ROT: 0; PHYS_PAGE: 180; LOCATION: R8C11; DRAWING: @RVP1_ADL_SB_ADP_S_DDR5_SODIMM_2DPC_LIB.H55_DG2_2DPC(SCH_1):PAGE549; CDS_LIB: discrete_2; VARIANT: ?; PCB Footprint: TK0_SMR4_0603_1800X1014_MB; CHIPS_PART_NAME: RES_4TERM_2; CDS_PART_NAME: RES_4TERM_2_0603-K72583-001,RES,0.01,1%,0.1W,TK0,GENERIC; CDS_LOCATION: R8C11; ASI_MODEL: K72583-001
R8F18 = RES_4TERM_2: CDS_PHYS_PART_NAME: RES_4TERM_2_0603-K72583-001,RES,0.01,1%,0.1W,TK0,GENERIC; CDS_LMAN_SYM_OUTLINE: -50,50,50,-50; FP_TECH: TK0; IP: GENERIC; ROOM: NONE; WATTAGE: 0.1W; OriginalSymbolOrigin: (-75,25); XY: (2000,3225); VER: 1; ROT: 0; PHYS_PAGE: 180; LOCATION: R8F18; DRAWING: @RVP1_ADL_SB_ADP_S_DDR5_SODIMM_2DPC_LIB.H55_DG2_2DPC(SCH_1):PAGE549; CDS_LIB: discrete_2; VARIANT: ?; PCB Footprint: TK0_SMR4_0603_1800X1014_MB; CHIPS_PART_NAME: RES_4TERM_2; CDS_PART_NAME: RES_4TERM_2_0603-K72583-001,RES,0.01,1%,0.1W,TK0,GENERIC; CDS_LOCATION: R8F18; ASI_MODEL: K72583-001
R8M44 = C_RES#1: PART_NUMBER: A93549-001; CHIPS_PART_NAME: C_RES; CDS_PHYS_PART_NAME: C_RES_0402-A93549-001,RES,0,5%,0.0625W,TK2,GENERIC; CDS_LMAN_SYM_OUTLINE: -50,50,50,-50; FP_TECH: TK2; IP: GENERIC; ROOM: NONE; OriginalSymbolOrigin: (-75,25); XY: (1500,6250); VER: 1; PHYS_PAGE: 180; LOCATION: R8M44; DRAWING: @RVP1_ADL_SB_ADP_S_DDR5_SODIMM_2DPC_LIB.H55_DG2_2DPC(SCH_1):PAGE549; CDS_LIB: c_discrete; VARIANT: ?; PCB Footprint: CTK2_SM0402_1100X550_MA; ROT: 0; CDS_PART_NAME: C_RES_0402-A93549-001,RES,0,5%,0.0625W,TK2,GENERIC; CDS_LOCATION: R8M44
U5B2 = SLG7NT402V_2: CDS_PHYS_PART_NAME: SLG7NT402V_2_LCC-G54192-001,IC,SLG7NT402V,TK2,GENERIC; CDS_LMAN_SYM_OUTLINE: -250,200,250,-200; FP_TECH: TK2; IP: GENERIC; PACK_TYPE: LCC; ROOM: NONE; OriginalSymbolOrigin: (-275,200); XY: (4925,3250); VER: 1; ROT: 0; PHYS_PAGE: 180; LOCATION: U5B2; DRAWING: @RVP1_ADL_SB_ADP_S_DDR5_SODIMM_2DPC_LIB.H55_DG2_2DPC(SCH_1):PAGE549; CDS_LIB: local; VARIANT: ?; PCB Footprint: TK2_LCC8_1550X2050_500_MA; SEC_TYPE: LCC; CHIPS_PART_NAME: SLG7NT402V_2; CDS_PART_NAME: SLG7NT402V_2_LCC-G54192-001,IC,SLG7NT402V,TK2,GENERIC; CDS_LOCATION: U5B2; ASI_MODEL: G54192-001
U8C1 = SLG7NT402V_2: CDS_PHYS_PART_NAME: SLG7NT402V_2_LCC-G54192-001,IC,SLG7NT402V,TK2,GENERIC; CDS_LMAN_SYM_OUTLINE: -250,200,250,-200; FP_TECH: TK2; IP: GENERIC; PACK_TYPE: LCC; ROOM: NONE; OriginalSymbolOrigin: (-275,200); XY: (3125,6525); VER: 1; ROT: 0; PHYS_PAGE: 180; LOCATION: U8C1; DRAWING: @RVP1_ADL_SB_ADP_S_DDR5_SODIMM_2DPC_LIB.H55_DG2_2DPC(SCH_1):PAGE549; CDS_LIB: local; VARIANT: ?; PCB Footprint: TK2_LCC8_1550X2050_500_MA; SEC_TYPE: LCC; CHIPS_PART_NAME: SLG7NT402V_2; CDS_PART_NAME: SLG7NT402V_2_LCC-G54192-001,IC,SLG7NT402V,TK2,GENERIC; CDS_LOCATION: U8C1
U8F2 = SLG7NT402V_2: CDS_PHYS_PART_NAME: SLG7NT402V_2_LCC-G54192-001,IC,SLG7NT402V,TK2,GENERIC; CDS_LMAN_SYM_OUTLINE: -250,200,250,-200; FP_TECH: TK2; IP: GENERIC; PACK_TYPE: LCC; ROOM: NONE; OriginalSymbolOrigin: (-275,200); XY: (875,3225); VER: 1; ROT: 0; PHYS_PAGE: 180; LOCATION: U8F2; DRAWING: @RVP1_ADL_SB_ADP_S_DDR5_SODIMM_2DPC_LIB.H55_DG2_2DPC(SCH_1):PAGE549; CDS_LIB: local; VARIANT: ?; PCB Footprint: TK2_LCC8_1550X2050_500_MA; SEC_TYPE: LCC; CHIPS_PART_NAME: SLG7NT402V_2; CDS_PART_NAME: SLG7NT402V_2_LCC-G54192-001,IC,SLG7NT402V,TK2,GENERIC; CDS_LOCATION: U8F2; ASI_MODEL: G54192-001